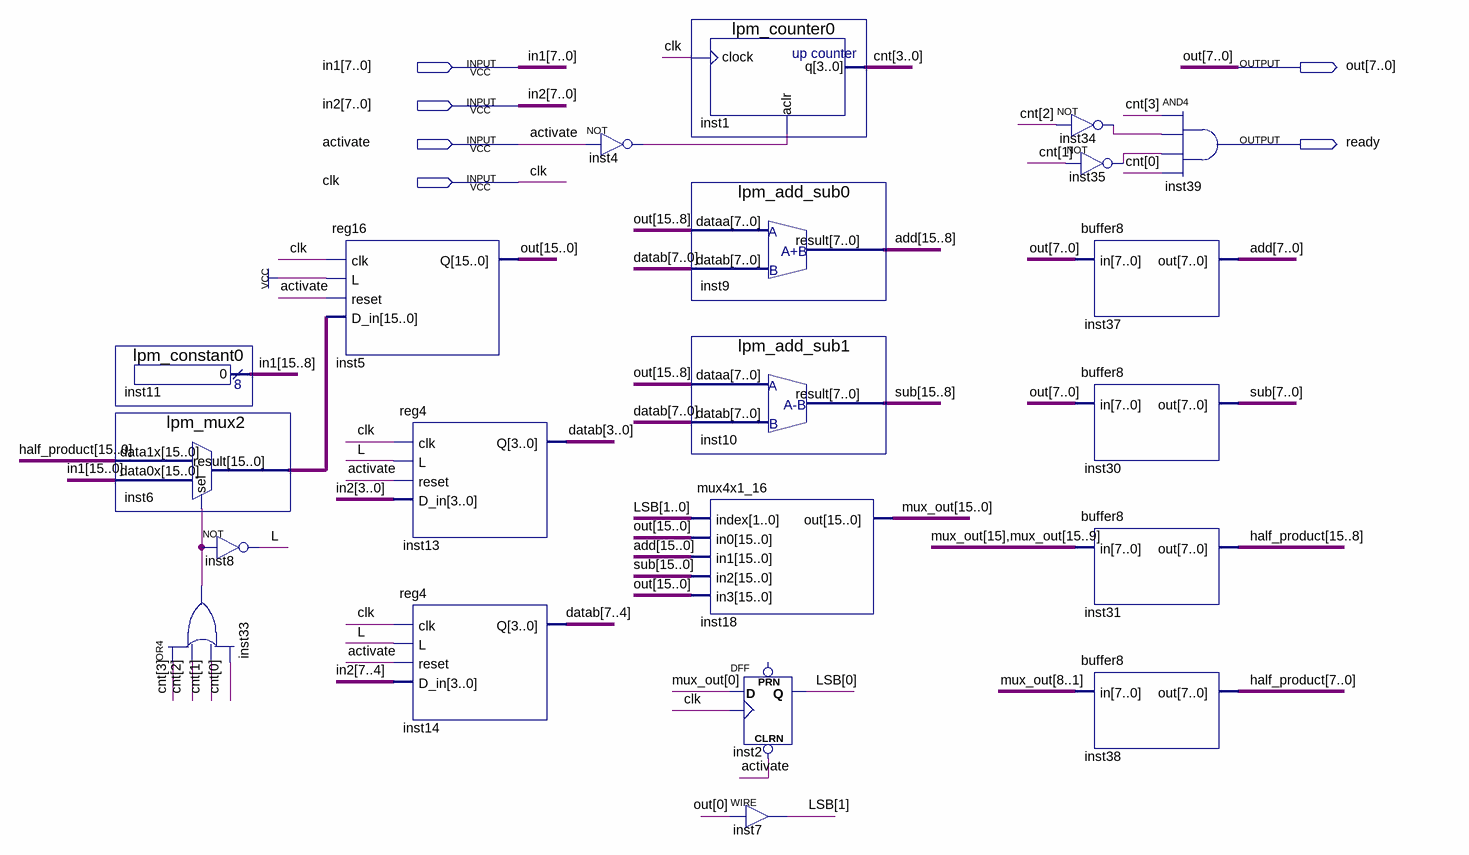
[diagram p0: schematic sheet]
// Quartus schematic booth.bdf as structural Verilog: 21 symbols, 6 pins
module booth (
  input  [15:0] in1,
  input  [7:0] in2,
  input  activate,
  input  clk,
  output [15:0] out,
  output ready
);

  wire inst4_out, inst33_out, inst34_out, inst35_out, L;
  wire [1:0] LSB;
  wire [3:0] cnt;
  wire [7:0] datab;
  wire [15:0] add, half_product, inst6_result, mux_out, sub;

  lpm_constant0 inst11 (.result(in1[15:8]));
  lpm_mux2 inst6 (.data1x(half_product), .data0x(in1), .sel(inst33_out), .result(inst6_result));
  not inst8 (L, inst33_out);
  or inst33 (inst33_out, cnt[3], cnt[2], cnt[1], cnt[0]);
  reg16 inst5 (.clk(clk), .L(1'b1), .reset(activate), .D_in(inst6_result), .Q(out));
  reg4 inst13 (.clk(clk), .L(L), .reset(activate), .D_in(in2[3:0]), .Q(datab[3:0]));
  reg4 inst14 (.clk(clk), .L(L), .reset(activate), .D_in(in2[7:4]), .Q(datab[7:4]));
  not inst4 (inst4_out, activate);
  lpm_counter0 inst1 (.clock(clk), .aclr(inst4_out), .q(cnt));
  lpm_add_sub0 inst9 (.dataa(out[15:8]), .datab(datab), .result(add[15:8]));
  lpm_add_sub1 inst10 (.dataa(out[15:8]), .datab(datab), .result(sub[15:8]));
  mux4x1_16 inst18 (.index(LSB), .in0(out), .in1(add), .in2(sub), .in3(out), .out(mux_out));
  DFF inst2 (.CLRN(activate), .CLK(clk), .D(mux_out[0]), .Q(LSB[0]));  // open: PRN
  assign LSB[1] = out[0];  // WIRE inst7
  not inst34 (inst34_out, cnt[2]);
  not inst35 (inst35_out, cnt[1]);
  buffer8 inst37 (.in(out[7:0]), .out(add[7:0]));
  buffer8 inst30 (.in(out[7:0]), .out(sub[7:0]));
  buffer8 inst31 (.in({{2{mux_out[15]}}, mux_out[14:9]}), .out(half_product[15:8]));
  buffer8 inst38 (.in(mux_out[8:1]), .out(half_product[7:0]));
  and inst39 (ready, cnt[3], inst34_out, inst35_out, cnt[0]);
endmodule
